# Altium schematic sheet Power_suply.SchDoc
size A4
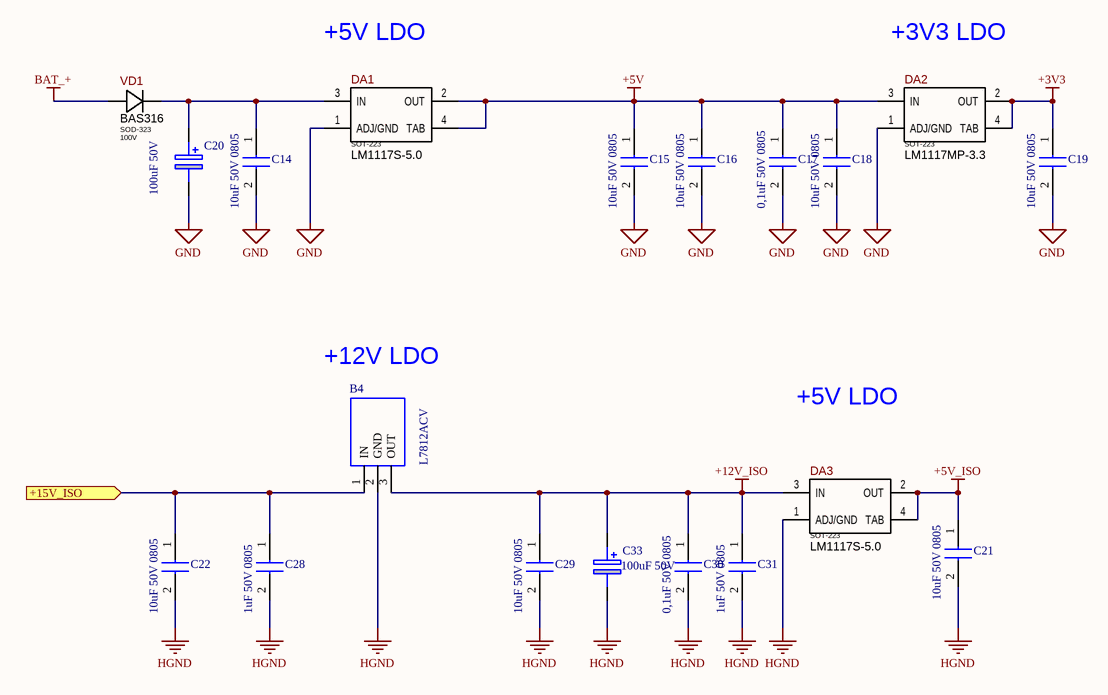
[diagram p0: Power_suply.SchDoc]

## Parts
B4  L7812ACV  [TO270P460X1020X2008-3P]
C14  10uF 50V 0805  [CAPC2012X90N]
C15  10uF 50V 0805  [CAPC2012X90N]
C16  10uF 50V 0805  [CAPC2012X90N]
C17  0,1uF 50V 0805  [CAPC2012X90N]
C18  10uF 50V 0805  [CAPC2012X90N]
C19  10uF 50V 0805  [CAPC2012X90N]
C20  100uF 50V  [CAPPRD500W60D870H1200]
C21  10uF 50V 0805  [CAPC2012X90N]
C22  10uF 50V 0805  [CAPC2012X90N]
C28  1uF 50V 0805  [CAPC2012X90N]
C29  10uF 50V 0805  [CAPC2012X90N]
C30  0,1uF 50V 0805  [CAPC2012X90N]
C31  1uF 50V 0805  [CAPC2012X90N]
C33  100uF 50V  [CAPPRD500W60D870H1200]
DA1  Part Number: LM1117S-5.0  [SOT-223]
DA2  Part Number: LM1117MP-3.3  [SOT-223]
DA3  Part Number: LM1117S-5.0  [SOT-223]
VD1  Package: SOD-323  Voltage: 100V  [SOD-323_MED]  (hidden comment: BAS316)

## Ports
+15V_ISO (in)

## Nets
+3V3: C19.1 DA2.2(OUT) DA2.4(TAB)
+5V: C15.1 C16.1 C17.1 C18.1 DA1.2(OUT) DA1.4(TAB) DA2.3(IN)
+5V_ISO: C21.1 DA3.2(OUT) DA3.4(TAB)
+12V_ISO: B4.3(OUT) C29.1 C30.1 C31.1 C33.1(+) DA3.3(IN)
BAT_+: VD1.AN
GND: C14.2 C15.2 C16.2 C17.2 C18.2 C19.2 C20.2(-) DA1.1(ADJ/GND) DA2.1(ADJ/GND)
HGND: B4.2(GND) C21.2 C22.2 C28.2 C29.2 C30.2 C31.2 C33.2(-) DA3.1(ADJ/GND)
+15V_ISO: B4.1(IN) C22.1 C28.1 ; port +15V_ISO
NetC14_1: C14.1 C20.1(+) DA1.3(IN) VD1.CA

## Notes on the sheet
- +5V LDO
- +3V3 LDO
- +12V LDO

## Library data of the parts
B4 = L7812ACV: TO220 voltage regulator,L7812ACV 12V 1A STMicroelectronics L7812ACV, Single Linear Voltage Regulator, 1A 12 V, 2%, 3-Pin TO-220; Geometry.Height: 4.6mm; Manufacturer_Name: STMicroelectronics; Manufacturer_Part_Number: L7812ACV; Mouser Part Number: 511-L7812ACV; Mouser Price/Stock: https://www.mouser.co.uk/ProductDetail/STMicroelectronics/L7812ACV?qs=bZskSr8d5Y9fWhq%2FyUrU3A%3D%3D; Arrow Part Number: L7812ACV; Arrow Price/Stock: https://www.arrow.com/en/products/l7812acv/stmicroelectronics?region=europe; Mouser Testing Part Number: *; Mouser Testing Price/Stock: *; Datasheet Link: http://www.st.com/web/en/resource/technical/document/datasheet/CD00000444.pdf
C14-C19 C21 C22 C28-C31 = MCMT21N470F250CT: Capacitor; Height: 0.9mm
C20 C33 = MAL203690109E3: Aluminum Electrolytic Capacitors - Radial Leaded 100uF 50V 20% Radial; Manufacturer_Name: Vishay; Geometry.Height: 12mm; Datasheet Link: https://www.vishay.com/docs/28312/036rsp.pdf; Manufacturer_Part_Number: MAL203690109E3; Mouser Part Number: 594-2222-036-90109; Mouser Price/Stock: https://www.mouser.co.uk/ProductDetail/Vishay-BC-Components/MAL203690109E3?qs=4T%252B5yYZyZYdFWMOgqUZuiA%3D%3D; Arrow Part Number: MAL203690109E3; Arrow Price/Stock: https://www.arrow.com/en/products/mal203690109e3/vishay; Mouser Testing Part Number: *; Mouser Testing Price/Stock: *
DA1 DA3 = LM1117MP-3.3: Linear Voltage Regulator IC 1 Output 800mA SOT-223; Package: SOT-223; Component Type: SMD; ComponentLink1URL: https://www.ti.com/lit/ds/symlink/lm1117.pdf; ComponentLink1Description: Datasheet
DA2 = LM1117MP-3.3: Linear Voltage Regulator IC 1 Output 800mA SOT-223; Manufacturer: Texas Instruments; Ajax_1C_ID: 9463; Ajax_1C_PN: LM1117MP-3.3 Molded SOT-223, 6.50 x 3.56 x 1.6mm Body, 4 Lead, 2.3mm Pitch MP04A_N	1SPX; Standard Lead Time: 6 Weeks; Component Status: On Review; Replacement: NONE; GUID_1C: e0b887c0-e6df-11e6-82a6-d8cb8a9acc66; Package: SOT-223; Part Type: Power / Linear Regulator; Component Type: SMD; Lifecycle: RND Only; Temperature Range: 0°C ~ 125°C; ComponentLink1URL: https://www.ti.com/lit/ds/symlink/lm1117.pdf; Supplier 1: Digi-Key; Supplier Part Number 1: LM1117MP-3.3/NOPBTR-ND; ComponentLink1Description: Datasheet
VD1 = BAS316: Diode Standard 100V 250mA, SOD-323/SC-76; Manufacturer: Nexperia USA Inc.; Ajax_1C_ID: 3460; Ajax_1C_PN: BAS316,115 100V 0.25A(DC) Nexperia diode SOD-323; Marking: A6; Standard Lead Time: 4 Weeks; Vf: 1.25V @ 150mA; Replacement: BAS316,115 BAS316,135; Ajax_1С_Status: Mass Production; Part Number: BAS316; Part Type: General; Component Type: SMD; Current: 250mA; Temperature Range: -65°C ~ 150°C; ComponentLink1URL: https://assets.nexperia.com/documents/data-sheet/BAS16_SER.pdf; Supplier 1: Digi-Key; Supplier Part Number 1: 1727-7370-2-ND; ComponentLink1Description: Datasheet; Price: 0,00753566